# EAGLE design wd-g0906wy (EAGLE 9.4.2)
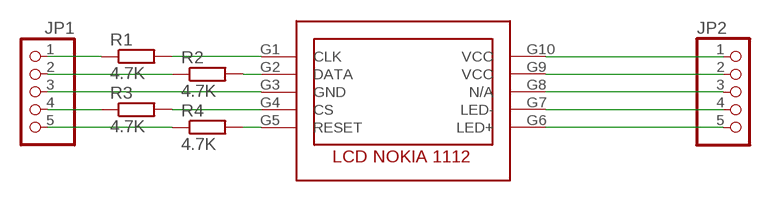
[diagram p0: schematic, sheet 1]

## Parts
HG1  WD-G0906WY  [WD-G0906WY]
JP1  PINHD-1X5  [1X05]
JP2  PINHD-1X5  [1X05]
R1  4.7K  R-EU_R1206  [R1206]
R2  4.7K  R-EU_R1206  [R1206]
R3  4.7K  R-EU_R1206  [R1206]
R4  4.7K  R-EU_R1206  [R1206]

## Nets
N$1: JP1.1 R1.1
N$2: JP1.2 R2.1
N$3: HG1.G3(GND) JP1.3
N$4: JP1.4 R3.1
N$5: JP1.5 R4.1
N$7: HG1.G9(VCC) JP2.2
N$8: HG1.G8(N/A) JP2.3
N$9: HG1.G7(LED-) JP2.4
N$10: HG1.G6(LED+) JP2.5
N$11: HG1.G1(CLK) R1.2
N$12: HG1.G2(DATA) R2.2
N$13: HG1.G4(CS) R3.2
N$14: HG1.G5(RESET) R4.2
N$15: HG1.G10(VCC) JP2.1

## Library data of the parts
HG1 = dragberry:WD-G0906WY
JP1 JP2 = pinhead:PINHD-1X5: PIN HEADER
R1-R4 = rcl:R-EU_: RESISTOR, European symbol; SPICEPREFIX: R

## Board
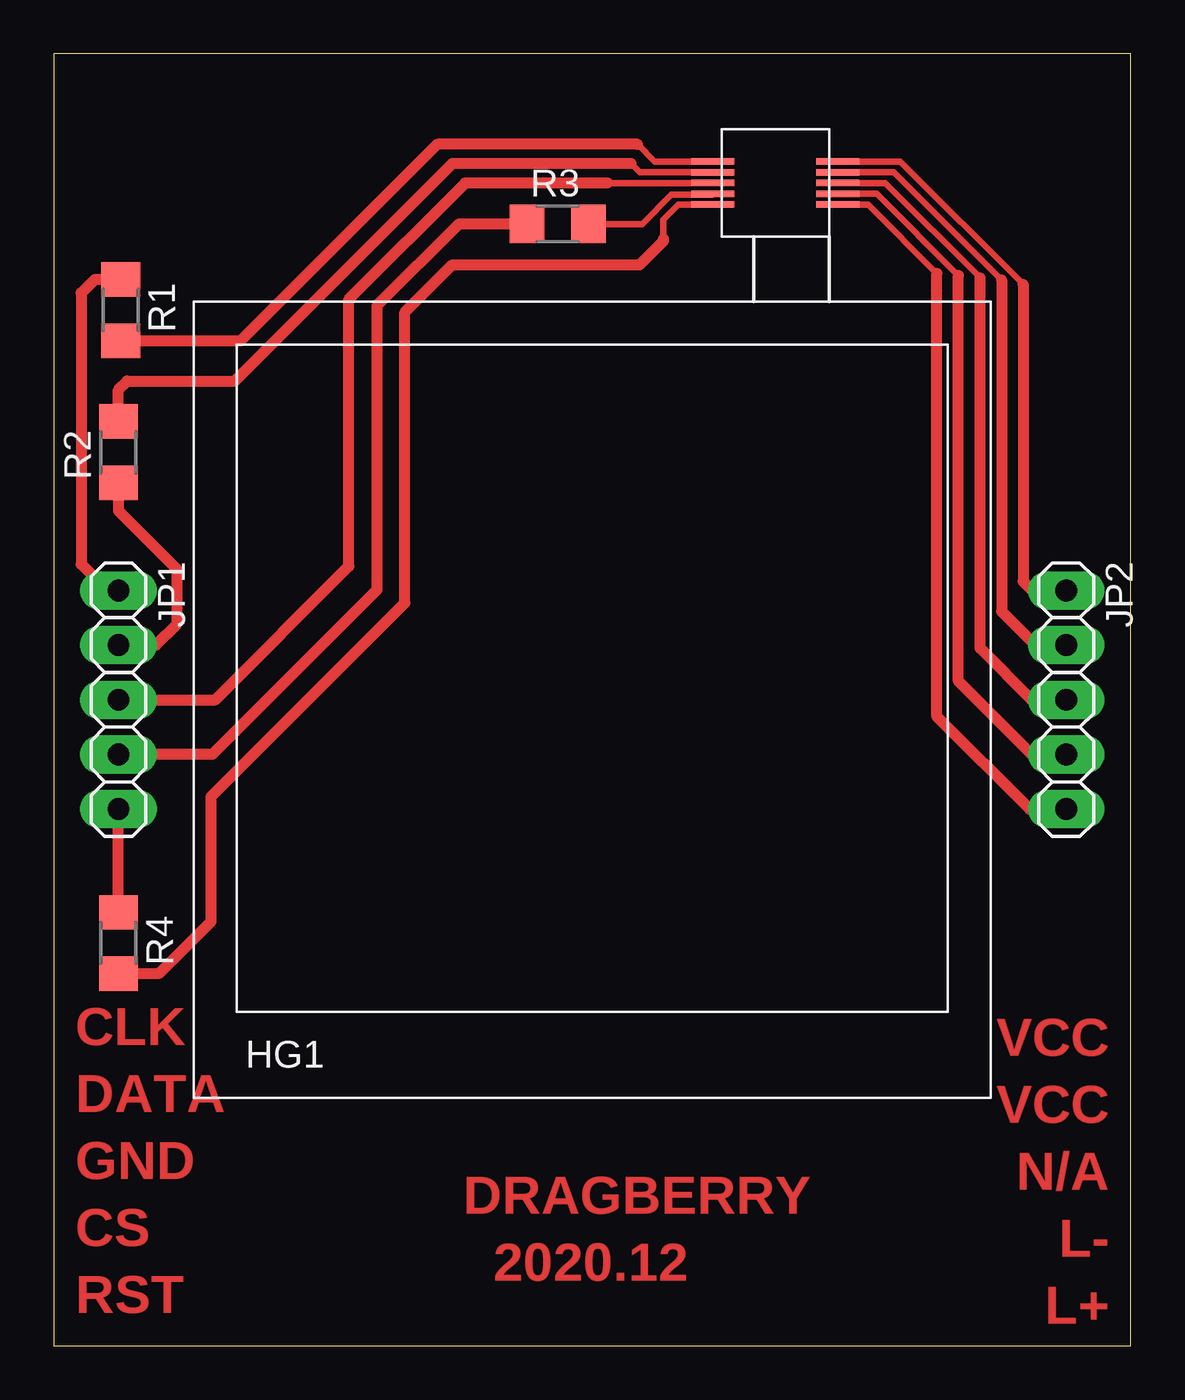
[diagram p1: board, top side]

Size 50 x 60 mm. Coordinates in mm from the lower left corner, seen from the top.
Outline: 0,0 50,0 50,60 0,60 0,0
Copper layers (1*16): Top 0.035mm / dielectric 1.5mm / Bottom 0.035mm
Design rules "default *": minimum track width 6mil, minimum drill 0.35mm, track to track 6mil, track to pad 6mil, pad to pad 6mil, via to via 6mil, smd to smd 6mil, copper to edge 40mil, drill to drill 6mil, minimum pad ring 15mil, minimum via ring 8mil, stop-mask expansion 4mil, vias tented up to drill 0mil, thermal gap 10mil

### Footprints (pad centres in the part's own frame; a part is rotated, then mirrored left to right if it is on the bottom)
WD-G0906WY = smd 2 x 0.305: G1 5.6,25; G2 5.6,24.5; G3 5.6,24; G4 5.6,23.5; G5 5.6,23; G6 11.4,23; G7 11.4,23.5; G8 11.4,24; G9 11.4,24.5; G10 11.4,25
1X05 = drill 1.016 long: 1 -5.08,0; 2 -2.54,0; 3 0,0; 4 2.54,0; 5 5.08,0
R1206 = smd 1.6 x 1.803: 1 -1.422,0; 2 1.422,0

### Placement (x,y rotation side)
HG1  25,30 0 top
JP1  3,30 270 top
JP2  47,30 270 top
R1  3.1,48.1 270 top
R2  3,41.5 90 top
R3  23.4,52.1 0 top
R4  3,18.7 270 top

### Tracks (layer width: path | path; a pad name or v marks a point on that pad's centre or on a via)
N$1
  Top 0.508: R1.1 1.9,49.52 1.27,48.89 1.27,36.3 2.49,35.08 JP1.1
N$2
  Top 0.508: 4.13,32.54 JP1.2 4.74,32.54 5.7,33.5 5.7,36.08 3,38.78 R2.1
N$3
  Top 0.203: 2.5,30 JP1.3
  Top 0.305: 25.7,54 HG1.G3
  Top 0.508: JP1.3 7.5,30 13.7,36.2 13.7,48.6 19.1,54 25.7,54
N$4
  Top 0.508: R3.1 18.8,52.1 15,48.3 15,35.1 7.36,27.46 JP1.4
N$5
  Top 0.508: R4.1 JP1.5
N$7
  Top 0.305: HG1.G9 39,54.5 44,49.5
  Top 0.508: JP2.2 45.56,32.54 44,34.1 44,49.5
N$8
  Top 0.203: 37,54 HG1.G8
  Top 0.305: 43,49.6 38.6,54 37,54
  Top 0.508: JP2.3 45.4,30 43,32.4 43,49.6
N$9
  Top 0.305: HG1.G7 38.2,53.5 42,49.7
  Top 0.508: JP2.4 45.4,27.46 42,30.86 42,49.7
N$10
  Top 0.203: 37,53 HG1.G6
  Top 0.305: 41,49.8 37.8,53 37,53
  Top 0.508: JP2.5 45.3,24.92 41,29.22 41,49.8
N$11
  Top 0.305: HG1.G1 27.9,55 27.1,55.8
  Top 0.508: 27.1,55.8 17.8,55.8 8.68,46.68 R1.2
N$12
  Top 0.305: HG1.G2 27.2,54.5 26.8,54.9
  Top 0.508: R2.2 3,44.4 3.4,44.8 8.4,44.8 18.5,54.9 26.8,54.9
N$13
  Top 0.305: HG1.G4 30.56,53.46 28.67,53.46 27.31,52.1 R3.2
N$14
  Top 0.305: HG1.G5 29,53 28.3,52.3 28.3,51.4
  Top 0.508: R4.2 3.02,17.3 4.9,17.3 7.3,19.7 7.3,25.5 16.3,34.5 16.3,48 18.5,50.2 27.2,50.2 28.3,51.3 28.3,51.4
N$15
  Top 0.305: 45,49.3 39.3,55 HG1.G10
  Top 0.508: JP2.1 45.42,35.08 45,35.5 45,49.3

### Text on the board
Top: DRAGBERRY / 2020.12 | CLK / DATA / GND / CS / RST | VCC / VCC / N/A / L- / L+